# EAGLE design siso (EAGLE 7.5.0)
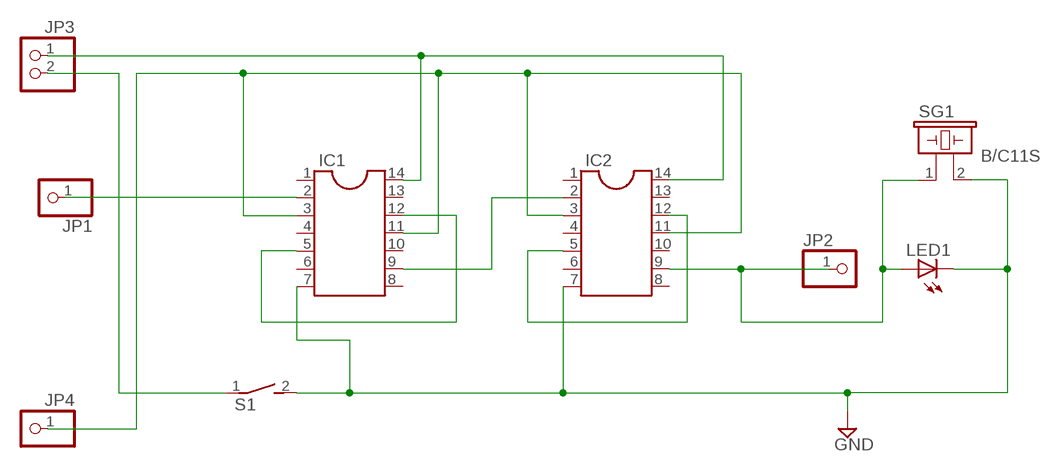
[diagram p0: schematic, sheet 1]

## Parts
IC1  DIL14  [DIL14]
IC2  DIL14  [DIL14]
JP1  PINHD-1X1  [1X01]
JP2  PINHD-1X1  [1X01]
JP3  PINHD-1X2  [1X02]
JP4  PINHD-1X1  [1X01]
LED1  LED5MM  [LED5MM]
S1  DS01E  [DS-01]
SG1  B/C11S  [B/C11S]

## Nets
GND: IC1.7 IC2.7 LED1.K(C) S1.2 SG1.2
N$1: IC1.5 IC1.12
N$2: IC1.9 IC2.2
N$4: IC1.3 IC1.11 IC2.3 IC2.11 JP4.1
N$5: IC2.5 IC2.12
N$6: IC2.9 JP2.1 LED1.A SG1.1
N$7: IC1.2 JP1.1
N$10: IC1.14 IC2.14 JP3.1
N$13: JP3.2 S1.1
Unconnected: IC1.1 IC1.4 IC1.6 IC1.8 IC1.10 IC1.13 IC2.1 IC2.4 IC2.6 IC2.8 IC2.10 IC2.13

## Library data of the parts
IC1 IC2 = ic-package:DIL14: Dual In Line / Socket
JP1 JP2 JP4 = pinhead:PINHD-1X1: PIN HEADER
JP3 = pinhead:PINHD-1X2: PIN HEADER
LED1 = led:LED: LED OSRAM: - CHIPLED LG R971, LG N971, LY N971, LG Q971, LY Q971, LO R971, LY R971 LH N974, LH R974 LS Q976, LO Q976, LY Q976 LO Q996 - Hyper CHIPLED LW Q18S LB Q993, LB Q99A, LB R99A - SideLED LS A670, LO A670, LY A670, LG A670, LP A670 LB A673, LV A673, LT A673, LW A673 LH A674 LY A675 LS A676, LA A676, LO A676, LY A676, LW A676 LS A679, LY A679, LG A679 - Hyper Micro SIDELED® LS Y876, LA Y876, LO Y876, LY Y876 LT Y87S - SmartLED LW L88C, LW L88S LB L89C, LB L89S, LG L890 LS L89K, LO L89K, LY L89K LS L896, LA L896, LO L896, LY L896 - TOPLED LS T670, LO T670, LY T670, LG T670, LP T670 LSG T670, LSP T670, LSY T670, LOP T670, LYG T670 LG T671, LOG T671, LSG T671 LB T673, LV T673, LT T673, LW T673 LH T674 LS T676, LA T676, LO T676, LY T676, LB T676, LH T676, LSB T676, LW T676 LB T67C, LV T67C, LT T67C, LS T67K, LO T67K, LY T67K, LW E67C LS E67B, LA E67B, LO E67B, LY E67B, LB E67C, LV E67C, LT E67C LW T67C LS T679, LY T679, LG T679 LS T770, LO T770, LY T770, LG T770, LP T770 LB T773, LV T773, LT T773, LW T773 LH T774 LS E675, LA E675, LY E675, LS T675 LS T776, LA T776, LO T776, LY T776, LB T776 LHGB T686 LT T68C, LB T68C - Hyper Mini TOPLED® LB M676 - Mini TOPLED Santana® LG M470 LS M47K, LO M47K, LY M47K Source: http://www.osram.convergy.de LUXEON: - LUMILED® LXK2-PW12-R00, LXK2-PW12-S00, LXK2-PW14-U00, LXK2-PW14-V00 LXK2-PM12-R00, LXK2-PM12-S00, LXK2-PM14-U00 LXK2-PE12-Q00, LXK2-PE12-R00, LXK2-PE12-S00, LXK2-PE14-T00, LXK2-PE14-U00 LXK2-PB12-K00, LXK2-PB12-L00, LXK2-PB12-M00, LXK2-PB14-N00, LXK2-PB14-P00, LXK2-PB14-Q00 LXK2-PR12-L00, LXK2-PR12-M00, LXK2-PR14-Q00, LXK2-PR14-R00 LXK2-PD12-Q00, LXK2-PD12-R00, LXK2-PD12-S00 LXK2-PH12-R00, LXK2-PH12-S00 LXK2-PL12-P00, LXK2-PL12-Q00, LXK2-PL12-R00 Source: www.luxeon.com KINGBRIGHT: KA-3528ASYC Source: www.kingbright.com
S1 = switch-dil:DS01E: DIL/CODE SWITCH; OC_FARNELL: unknown; OC_NEWARK: unknown
SG1 = buzzer:B/C11S: BUZZER Source: Buerklin; OC_FARNELL: unknown; OC_NEWARK: unknown

## Board
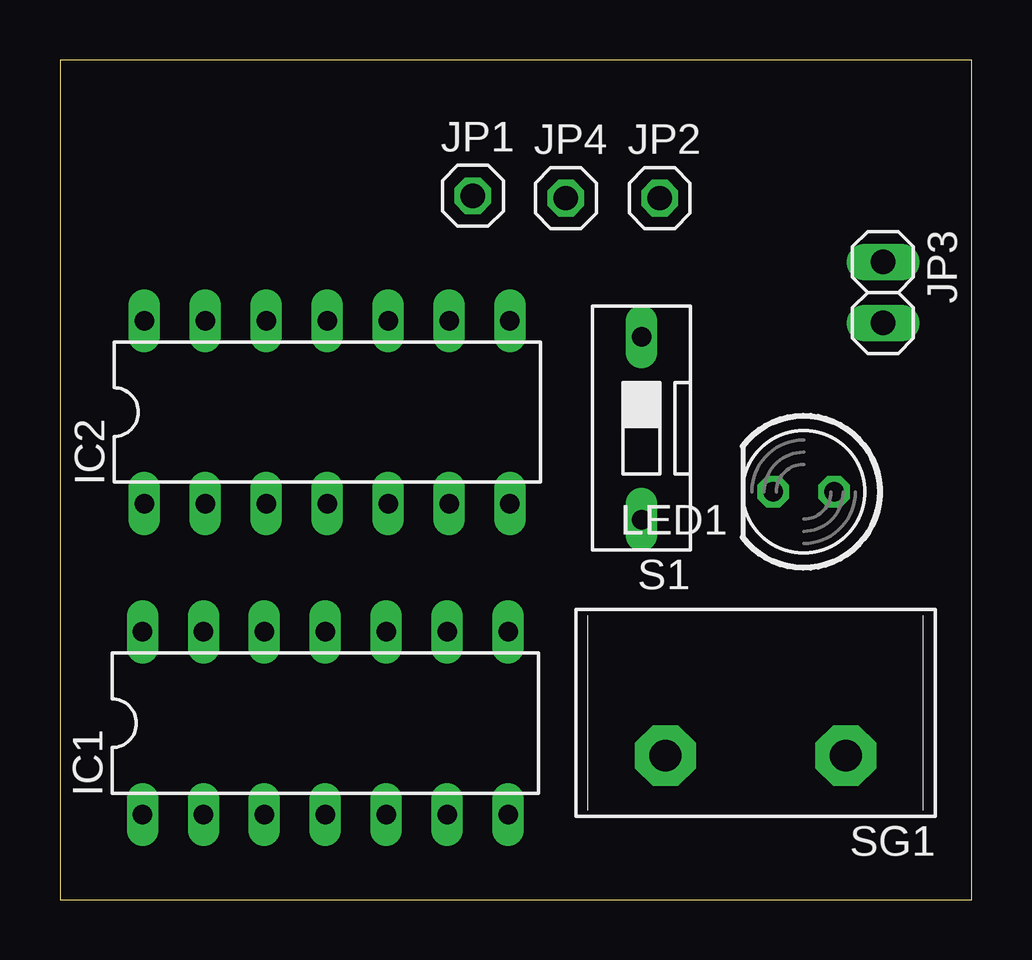
[diagram p1: board, top side]
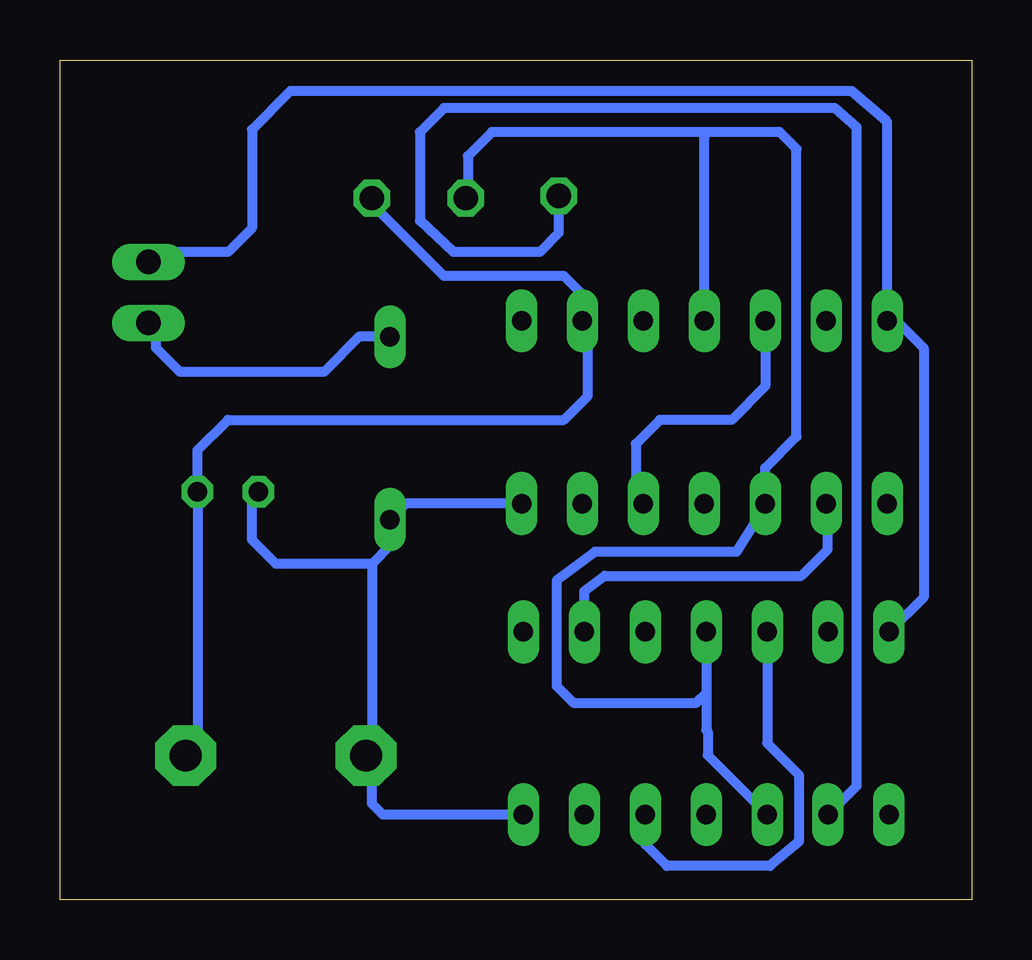
[diagram p2: board, bottom side, seen from below]

Size 38 x 35 mm. Coordinates in mm from the lower left corner, seen from the top.
Outline: 0,0 38,0 38,35 0,35 0,0
Copper layers (1*16): Top 0.035mm / dielectric 1.5mm / Bottom 0.035mm
Design rules "default": minimum track width 10mil, minimum drill 24mil, track to track 8mil, track to pad 8mil, pad to pad 8mil, via to via 8mil, smd to smd 8mil, copper to edge 40mil, drill to drill 8mil, minimum pad ring 10mil, minimum via ring 8mil, stop-mask expansion 4mil, vias tented up to drill 0mil, thermal gap 10mil

### Footprints (pad centres in the part's own frame; a part is rotated, then mirrored left to right if it is on the bottom)
DIL14 = drill 0.813 long: 1 -7.62,-3.81; 2 -5.08,-3.81; 3 -2.54,-3.81; 4 0,-3.81; 5 2.54,-3.81; 6 5.08,-3.81; 7 7.62,-3.81; 8 7.62,3.81; 9 5.08,3.81; 10 2.54,3.81; 11 0,3.81; 12 -2.54,3.81; 13 -5.08,3.81; 14 -7.62,3.81
1X01 = drill 1.016 octagon: 1 0,0
1X02 = drill 1.016 long: 1 -1.27,0; 2 1.27,0
LED5MM = drill 0.813 octagon: A -1.27,0; K 1.27,0
DS-01 = drill 0.813 long: 1 0,-3.81; 2 0,3.81
B/C11S = drill 1.321 pad 2.54 octagon: 1 -3.759,0; 2 3.759,0

### Placement (x,y rotation side)
IC1  11.06,7.35 0 top
IC2  11.14,20.32 0 top
JP1  17.21,29.34 0 top
JP2  25,29.24 0 top
JP3  34.31,25.31 270 top
JP4  21.09,29.24 0 top
LED1  31,17 180 top
S1  24.24,19.65 180 top
SG1  29,6 180 top

### Tracks (layer width: path | path; a pad name or v marks a point on that pad's centre or on a via)
GND
  Bottom 0.406: IC1.7 24.54,3.54 25,4 25,5.76 SG1.2 25,6.24 25,14 | 25,14 24.24,14.76 S1.2 23.57,16.51 IC2.7 | 25,14 29,14 30,15 30,16.73 LED1.K
N$1
  Bottom 0.406: IC1.12 8.52,6.52 7.2,5.2 7.2,2.4 8.4,1.4 12.7,1.4 13.6,2.3 IC1.5
N$2
  Bottom 0.406: IC1.9 16.14,12.86 15.3,13.5 7.1,13.5 6,14.6 6,16.45 IC2.2
N$4
  Bottom 0.406: IC1.11 11.06,8.6 | 11.06,8.6 11.06,7.06 11,7 11,6.02 IC1.3 | 11.06,8.6 11.46,8.2 16.6,8.2 17.3,8.9 17.3,13.3 15.7,14.5 9.8,14.5 8.6,16.4 IC2.3 8.6,18 7.3,19.3 7.3,31.3 8,32 11,32 | 11,32 20,32 21,31 21,29.33 JP4.1 | IC2.11 11.14,31.86 11,32
N$5
  Bottom 0.406: IC2.12 8.6,21.4 10,20 13,20 14,19 14,16.83 IC2.5
N$6
  Bottom 0.406: SG1.1 32.27,6.49 LED1.A 32.27,18.73 31,20 17,20 16,21 16,23.91 IC2.9 16.22,25.22 17,26 22,26 25,29 JP2.1
N$7
  Bottom 0.406: JP1.1 17.21,27.79 18,27 21.6,27 23,28.3 23,32 22,33 5.7,33 4.8,32.2 4.8,4.72 IC1.2
N$10
  Bottom 0.406: IC1.14 2,12.6 2,23 3.13,24.13 IC2.14 3.52,32.42 5,33.7 28.4,33.7 30,32.1 30,28 31,27 33.89,27 JP3.1
N$13
  Bottom 0.406: S1.1 25.54,23.46 27,22 33,22 34,23 34,23.73 JP3.2